# Altium schematic sheet Memory_EEPROM.SchDoc
size B; Author: E. Sims; Organization: Let's Build Rockets Inc.; SheetNumber: 6; SheetTotal: 16
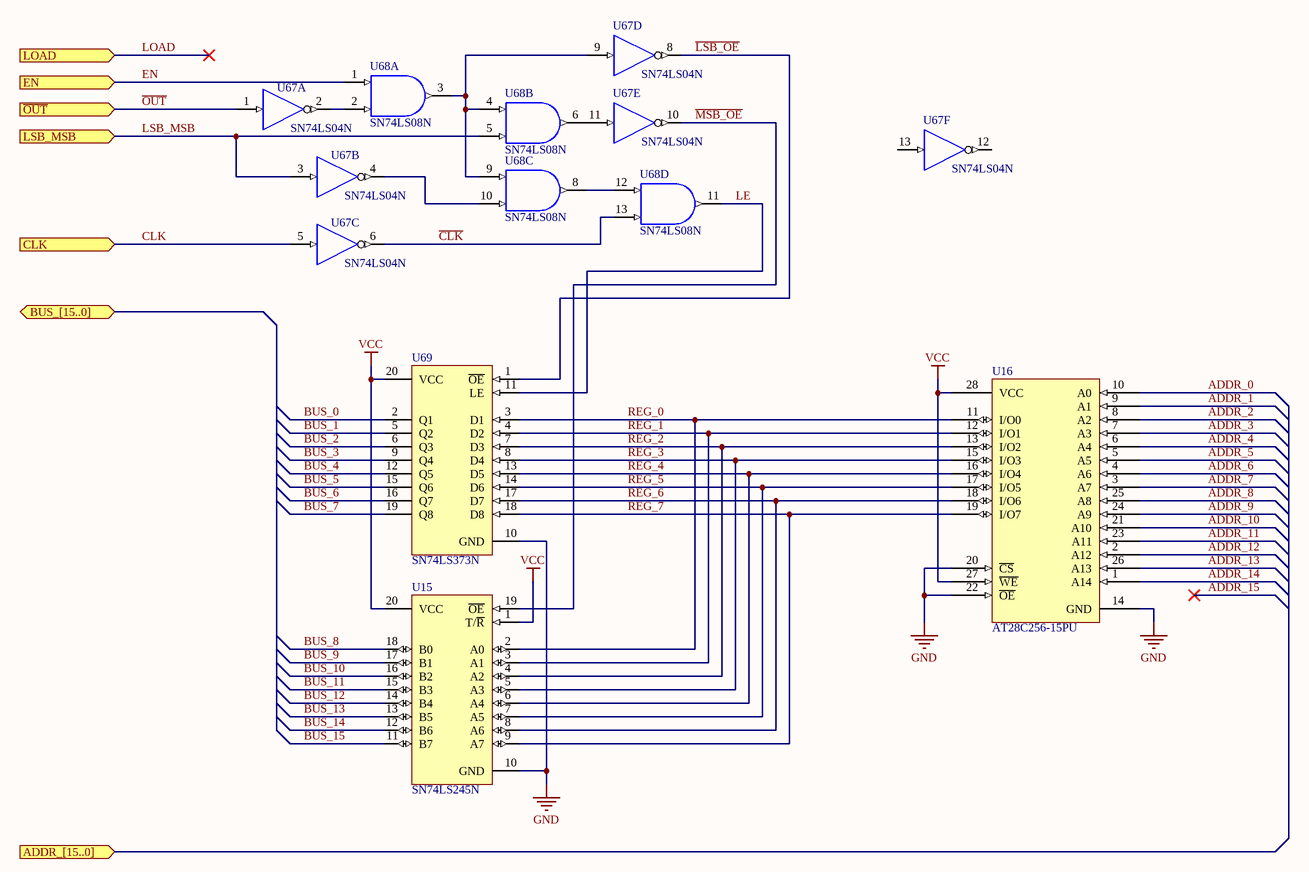
[diagram p0: Memory_EEPROM.SchDoc]

## Parts
U15  SN74LS245N  [N020]
U16  AT28C256-15PU  [J028]
U67  SN74LS04N  [N014]  (parts A,B,C,D,E,F of 6)
U68  SN74LS08N  [N014]  (parts A,B,C,D of 4)
U69  SN74LS373N  [N020]

## Ports
ADDR_[15..0] (in), BUS_[15..0] (bidir), CLK (in), EN (in), LOAD (in), LSB_MSB (in), ~{OUT} (in)

## Nets
GND: U15.10(GND) U16.14(GND) U16.20(~{CS}) U16.22(~{OE}) U67.7(GND) U68.7(GND) U69.10(GND)
VCC: U15.1(T/~{R}) U15.20(VCC) U16.27(~{WE}) U16.28(VCC) U67.14(VCC) U68.14(VCC) U69.20(VCC)
ADDR_0: U16.10(A0)
ADDR_1: U16.9(A1)
ADDR_2: U16.8(A2)
ADDR_3: U16.7(A3)
ADDR_4: U16.6(A4)
ADDR_5: U16.5(A5)
ADDR_6: U16.4(A6)
ADDR_7: U16.3(A7)
ADDR_8: U16.25(A8)
ADDR_9: U16.24(A9)
ADDR_10: U16.21(A10)
ADDR_11: U16.23(A11)
ADDR_12: U16.2(A12)
ADDR_13: U16.26(A13)
ADDR_14: U16.1(A14)
BUS_0: U69.2(Q1)
BUS_1: U69.5(Q2)
BUS_2: U69.6(Q3)
BUS_3: U69.9(Q4)
BUS_4: U69.12(Q5)
BUS_5: U69.15(Q6)
BUS_6: U69.16(Q7)
BUS_7: U69.19(Q8)
BUS_8: U15.18(B0)
BUS_9: U15.17(B1)
BUS_10: U15.16(B2)
BUS_11: U15.15(B3)
BUS_12: U15.14(B4)
BUS_13: U15.13(B5)
BUS_14: U15.12(B6)
BUS_15: U15.11(B7)
~{CLK}: U67.6(Y) U68.13(B)
CLK: U67.5(A) ; port CLK
EN: U68.1(A) ; port EN
~{LSB_OE}: U67.8(Y) U69.1(~{OE})
LE: U68.11(Y) U69.11(LE)
LOAD: port LOAD
LSB_MSB: U67.3(A) U68.5(B) ; port LSB_MSB
~{MSB_OE}: U15.19(~{OE}) U67.10(Y)
~{OUT}: U67.1(A) ; port ~{OUT}
REG_0: U15.2(A0) U16.11(I/O0) U69.3(D1)
REG_1: U15.3(A1) U16.12(I/O1) U69.4(D2)
REG_2: U15.4(A2) U16.13(I/O2) U69.7(D3)
REG_3: U15.5(A3) U16.15(I/O3) U69.8(D4)
REG_4: U15.6(A4) U16.16(I/O4) U69.13(D5)
REG_5: U15.7(A5) U16.17(I/O5) U69.14(D6)
REG_6: U15.8(A6) U16.18(I/O6) U69.17(D7)
REG_7: U15.9(A7) U16.19(I/O7) U69.18(D8)
NetU67_2: U67.2(Y) U68.2(B)
NetU67_4: U67.4(Y) U68.10(B)
NetU67_9: U67.9(A) U68.3(Y) U68.4(A) U68.9(A)
NetU67_11: U67.11(A) U68.6(Y)
NetU68_8: U68.8(Y) U68.12(A)

Not connected (* = marked no-connect by the designer): U67 12(Y) 13(A)

## Notes on the sheet
- Let's Build Rocket's Inc. Modular Paylaod System Based on TMP-010 Rev
  For more information visit https://github.com/LetsBuildRockets/Modular-Payload-System
  This work is licensed under CC BY-NC 4.0. To view a copy of this license, visit https://creativecommons.org/licenses/by-nc/4.0
- Title
- Size:
- Date:
- Assembly Variant:
- B
- Number:
- Time:
- Revision:
- Sheet
- of
- Author:
- File:

## Library data of the parts
U15 = SN74LS245N: Octal Bus Transceiver with 3-State Outputs; Published: 8-Jun-2000; LatestRevisionDate: 04-Mar-2005; LatestRevisionNote: Stylized 3D Model Added.; DatasheetVersion: Mar-1988; PackageVersion: Oct-1995; PackageReference: N020; Publisher: Altium Limited; PackageDescription: DIP; 20 Leads; Row Spacing 7.62 mm; Pitch 2.54 mm; ComponentLink1Description: Manufacturer Link; ComponentLink1URL: http://www.ti.com/; ComponentLink2Description: Datasheet; ComponentLink2URL: http://www-s.ti.com/sc/ds/sn74ls245.pdf
U67 = SN74LS04N: Hex Inverter; Published: 8-Jun-2000; LatestRevisionDate: 04-Mar-2005; LatestRevisionNote: Stylized 3D Model Added.; DatasheetVersion: Mar-1988; PackageVersion: Oct-1995; PackageReference: N014; Publisher: Altium Limited; PackageDescription: DIP; 14 Leads; Row Spacing 7.62 mm; Pitch 2.54 mm; ComponentLink1Description: Manufacturer Link; ComponentLink1URL: http://www.ti.com/; ComponentLink2Description: Datasheet; ComponentLink2URL: http://www-s.ti.com/sc/ds/sn74ls04.pdf
U68 = SN74LS08N: Quadruple 2-Input Positive-AND Gate; Published: 8-Jun-2000; LatestRevisionDate: 04-Mar-2005; LatestRevisionNote: Stylized 3D Model Added.; DatasheetVersion: Mar-1988; PackageVersion: Oct-1995; PackageReference: N014; Publisher: Altium Limited; PackageDescription: DIP; 14 Leads; Row Spacing 7.62 mm; Pitch 2.54 mm; ComponentLink1Description: Manufacturer Link; ComponentLink1URL: http://www.ti.com/; ComponentLink2Description: Datasheet; ComponentLink2URL: http://www-s.ti.com/sc/ds/SN74LS08.pdf
U69 = SN74LS373N: Octal D-Type Transparent Latche and Edge-Triggered Flip-Flops; Published: 8-Jun-2000; LatestRevisionDate: 04-Mar-2005; LatestRevisionNote: Stylized 3D Model Added.; DatasheetVersion: Mar-1988; PackageVersion: Oct-1995; PackageReference: N020; Publisher: Altium Limited; PackageDescription: DIP; 20 Leads; Row Spacing 7.62 mm; Pitch 2.54 mm; ComponentLink1Description: Manufacturer Link; ComponentLink1URL: http://www.ti.com/; ComponentLink2Description: Datasheet; ComponentLink2URL: http://www-s.ti.com/sc/ds/sn74s373.pdf